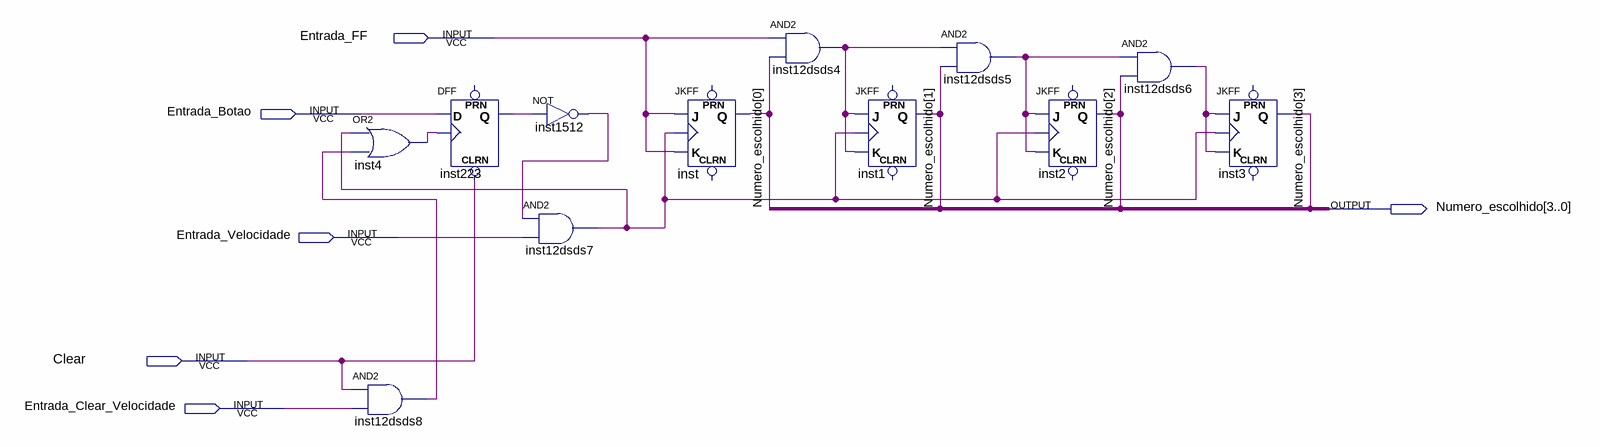
[diagram p0: schematic sheet]
// Quartus schematic seletor_escolha_4_clear.bdf as structural Verilog: 12 symbols, 6 pins
module seletor_escolha_4_clear (
  input  Entrada_FF,
  input  Entrada_Botao,
  input  Entrada_Velocidade,
  input  Clear,
  input  Entrada_Clear_Velocidade,
  output [3:0] Numero_escolhido
);

  wire inst4_out, inst12dsds4_out, inst12dsds5_out, inst12dsds6_out, inst12dsds7_out, inst12dsds8_out,
       inst223_q, inst1512_out;

  or inst4 (inst4_out, inst12dsds7_out, inst12dsds8_out);
  and inst12dsds8 (inst12dsds8_out, Clear, Entrada_Clear_Velocidade);
  DFF inst223 (.CLRN(Clear), .CLK(inst4_out), .D(Entrada_Botao), .Q(inst223_q));  // open: PRN
  not inst1512 (inst1512_out, inst223_q);
  and inst12dsds7 (inst12dsds7_out, inst1512_out, Entrada_Velocidade);
  JKFF inst (.K(Entrada_FF), .J(Entrada_FF), .CLK(inst12dsds7_out), .Q(Numero_escolhido[0]));  // open: PRN, CLRN
  and inst12dsds4 (inst12dsds4_out, Entrada_FF, Numero_escolhido[0]);
  JKFF inst1 (
    .K(inst12dsds4_out), .J(inst12dsds4_out), .CLK(inst12dsds7_out), .Q(Numero_escolhido[1]));  // open: PRN, CLRN
  and inst12dsds5 (inst12dsds5_out, inst12dsds4_out, Numero_escolhido[1]);
  JKFF inst2 (
    .K(inst12dsds5_out), .J(inst12dsds5_out), .CLK(inst12dsds7_out), .Q(Numero_escolhido[2]));  // open: PRN, CLRN
  and inst12dsds6 (inst12dsds6_out, inst12dsds5_out, Numero_escolhido[2]);
  JKFF inst3 (
    .K(inst12dsds6_out), .J(inst12dsds6_out), .CLK(inst12dsds7_out), .Q(Numero_escolhido[3]));  // open: PRN, CLRN
endmodule
